# EAGLE design TPS26600 Module (EAGLE 9.6.2)
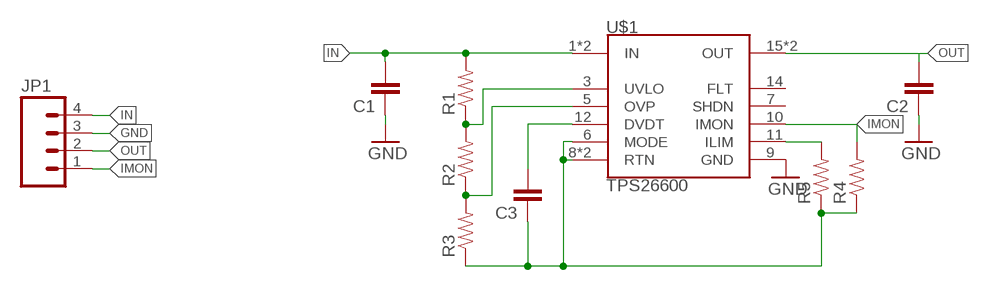
[diagram p0: schematic, sheet 1]

## Parts
C1  CAP0603-CAP  [0603-CAP]
C2  CAP0603-CAP  [0603-CAP]
C3  CAP0603-CAP  [0603-CAP]
JP1  M04_SLIM  [1X04_SLIM]
R1  RESISTOR0603  [0603-RES]
R2  RESISTOR0603  [0603-RES]
R3  RESISTOR0603  [0603-RES]
R4  RESISTOR0603  [0603-RES]
R5  RESISTOR0603  [0603-RES]
U$1  TPS26600  [HTSSOP-16]

## Nets
GND: C1.1 C2.1 JP1.3 U$1.9(GND)
IMON: JP1.1 R4.2 U$1.10(IMON)
IN: C1.2 JP1.4 R1.2 U$1.1(IN) U$1.2(IN)
N$3: R1.1 R2.2 U$1.3(UVLO)
N$4: R2.1 R3.2 U$1.5(OVP)
N$5: C3.2 U$1.12(DVDT)
N$6: R5.2 U$1.11(ILIM)
N$8: C3.1 R3.1 R4.1 R5.1 U$1.6(MODE) U$1.8(RTN) U$1.PAD(RTN)
OUT: C2.2 JP1.2 U$1.15(OUT) U$1.16(OUT)
Unconnected: U$1.7(SHDN) U$1.14(FLT)

## Library data of the parts
C1-C3 = HyTechDevices:CAP: Capacitor Standard 0603 ceramic capacitor, and 0.1" leaded capacitor.
JP1 = HyTechDevices:M04: Standard 4-pin 0.1" header. NOTES ON THE VARIANTS LOCK and LOCK_LONGPADS... This footprint was designed to help hold the alignment of a through-hole component (i.e. 6-pin header) while soldering it into place. You may notice that each hole has been shifted either up or down by 0.005 of an inch from it's more standard position (which is a perfectly straight line). This slight alteration caused the pins (the squares in the middle) to touch the edges of the holes. Because they are alternating, it causes a "brace" to hold the component in place. 0.005 has proven to be the perfect amount of "off-center" position when using our standard breakaway headers. Although looks a little odd when you look at the bare footprint, once you have a header in there, the alteration is very hard to notice. Also,if you push a header all the way into place, it is covered up entirely on the bottom side. This idea of altering the position of holes to aid alignment will be further integrated into the Sparkfun Library for other footprints. It can help hold any component with 3 or more connection pins. Note: The Sparkfun version includes many other packages including surface mount that may be of future interest. Source: Sparkfun <https://github.com/sparkfun/SparkFun-Eagle-Libraries>
R1-R5 = HyTechDevices:RESISTOR: Resistor Basic schematic elements and footprints for 0603, 1206, and PTH resistors.
U$1 = HyTechDevices:TPS26600

## Board
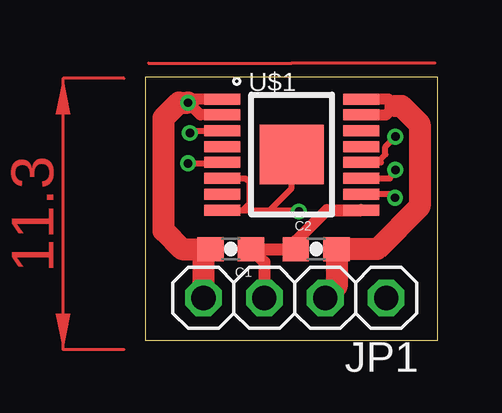
[diagram p1: board, top side]
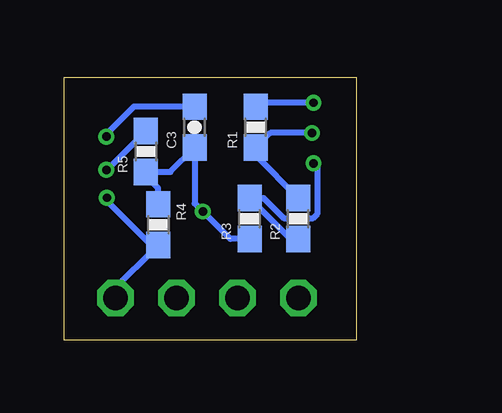
[diagram p2: board, bottom side, seen from below]

Size 12.17 x 10.97 mm. Coordinates in mm from the lower left corner, seen from the top.
Outline: 0,0 12.17,0 12.17,10.97 0,10.97 0,0
Copper layers (1*16): Top 0.035mm / dielectric 1.53mm / Bottom 0.035mm
Design rules "JLCPCB (2 Layer)": minimum track width 5mil, minimum drill 0.3mm, track to track 5mil, track to pad 5mil, pad to pad 5mil, via to via 20mil, smd to smd 5mil, copper to edge 0.2mm, drill to drill 21mil, minimum pad ring 6mil, minimum via ring 6mil, stop-mask expansion 6mil, vias tented up to drill 30mil, thermal gap 10mil

### Footprints (pad centres in the part's own frame; a part is rotated, then mirrored left to right if it is on the bottom)
0603-CAP = smd 1.1 x 1: 1 -0.85,0; 2 0.85,0
1X04_SLIM = drill 1.016 octagon: 1 -3.81,0; 2 -1.27,0; 3 1.27,0; 4 3.81,0
0603-RES = smd 1.1 x 1: 1 -0.85,0; 2 0.85,0
HTSSOP-16 = smd 1.499 x 0.457: 1 -2.896,2.311; 2 -2.896,1.651; 3 -2.896,0.991; 4 -2.896,0.33; 5 -2.896,-0.33; 6 -2.896,-0.991; 7 -2.896,-1.651; 8 -2.896,-2.311; 9 2.896,-2.311; 10 2.896,-1.651; 11 2.896,-0.991; 12 2.896,-0.33; 13 2.896,0.33; 14 2.896,0.991; 15 2.896,1.651; 16 2.896,2.311 | smd 2.667 x 2.464: PAD 0,0

### Placement (x,y rotation side)
C1  3.56,3.81 180 top
C2  7.11,3.81 0 top
C3  6.73,8.89 90 bottom
JP1  6.22,1.78 180 top
R1  4.19,8.89 90 bottom
R2  2.41,5.08 90 bottom
R3  4.44,5.08 90 bottom
R4  8.26,4.83 270 bottom
R5  8.76,7.87 90 bottom
U$1  6.1,7.75 0 top

### Tracks (layer width: path | path; a pad name or v marks a point on that pad's centre or on a via)
GND
  Top 0.254: 6.26,3.85 C2.1
  Top 0.508: U$1.9 7.56,5.44 6.26,4.14 C2.1 C1.1 4.95,3.26 JP1.3
IMON  (via drill 0.35)
  Top 0.254: 9.27,6.1 U$1.10 10.14,6.1 10.29,5.95 v10.39,5.95
  Bottom 0.254: 7.91,4.32 R4.2 8.4,3.83 | 8.4,3.83 10.03,2.2 JP1.1 | v10.39,5.95 10.39,5.82 8.4,3.83
IN  (via drill 0.35)
  Top 0.457: U$1.2 2.29,9.4 v1.78,9.91 1.93,10.06 U$1.1
  Top 0.914: JP1.4 2.41,3.52 C1.2 1.52,3.81 0.76,4.57 0.76,9.27 1.4,9.91 v1.78,9.91
  Bottom 0.254: 4.15,9.78 R1.2 4.02,9.91 v1.78,9.91
N$3  (via drill 0.35)
  Top 0.254: v1.85,8.65 1.94,8.74 U$1.3
  Bottom 0.254: R2.2 4.19,7.71 R1.1 3.58,8.65 v1.85,8.65
N$4  (via drill 0.35)
  Top 0.254: v1.78,7.38 3.16,7.38 U$1.5
  Bottom 0.254: R2.1 2.75,4.23 R3.2 3.86,5.93 3.03,5.1 1.8,5.1 1.63,5.26 1.63,7.24 v1.78,7.38
N$5  (via drill 0.35)
  Top 0.254: U$1.12 9.27,7.42 9.67,7.42 | 9.67,7.42 9.81,7.42 | v10.41,8.49 10,8.07 10,7.74 9.67,7.42
  Bottom 0.254: 6.69,9.74 C3.2 9.27,9.74 10.41,8.6 v10.41,8.49
N$6  (via drill 0.35)
  Top 0.254: U$1.11 10.19,6.76 v10.41,7.11
  Bottom 0.254: 8.68,8.72 R5.2 10.38,7.11 v10.41,7.11
N$8  (via drill 0.35)
  Top 0.254: U$1.8 4.06,5.44 | 4.06,5.44 5.18,5.44 | 5.18,5.44 6.1,6.35 U$1.PAD | U$1.6 4.17,6.76 4.32,6.6 4.32,5.69 4.06,5.44 | v6.39,5.38 6.33,5.44 5.18,5.44
  Bottom 0.254: R3.1 5.25,4.23 v6.39,5.38 6.73,5.71 C3.1 7.75,7.02 R5.1 8.85,6.94 8.26,6.35 R4.1
OUT
  Top 0.457: U$1.15 10.03,9.4 10.41,9.78 10.13,10.06 U$1.16
  Top 0.914: 10.41,9.78 10.67,9.78 11.43,9.02 11.43,5.59 9.65,3.81 C2.2 7.96,2.25 JP1.2
(copper drawn outside any net)
  shapes: Top area x2